# Altium schematic sheet Sheet1.SchDoc
size A4; Engineer: Nhóm 15
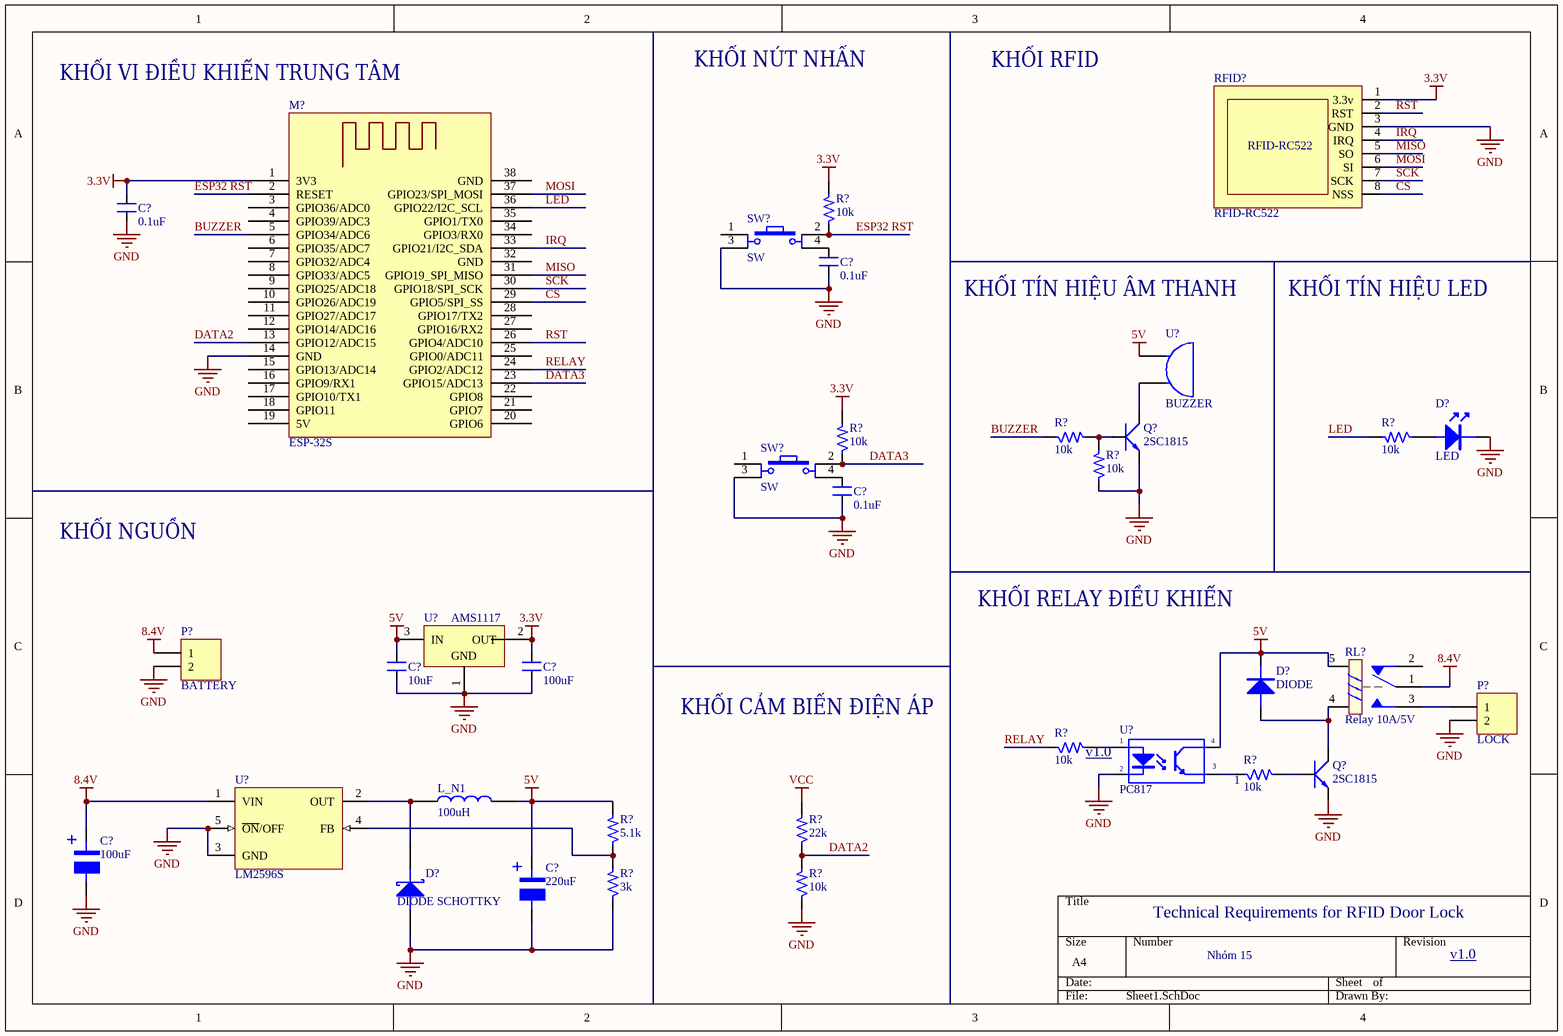
[diagram p0: Sheet1.SchDoc]

## Parts
(Parts that share a designator on the sheet are numbered #1, #2 ... from top to bottom, then left to right.)
C?#1  0.1uF  [CN4]
C?#2  0.1uF  [CN4]
C?#3  0.1uF  [CN4]
C?#4  10uF  [CN4]
C?#5  100uF  [CN4]
C?#6  100uF  [100UF/16V_SMD]
C?#7  220uF  [100UF/16V_SMD]
D?#1  LED  [CAP10UF]
D?#2  DIODE  [SMB]
D?#3  DIODE SCHOTTKY  [SMA]
L_N1  100uH  [100UH]
M?  ESP-32S  [ESP32 NodeMCU]
P?#1  BATTERY  [CON 2]
P?#2  LOCK  [CON 2]
Q?#1  2SC1815  [TO92-123]
Q?#2  2SC1815  [TO92-123]
R?#1  10k  [SM-0805]
R?#2  10k  [SM-0805]
R?#3  10k  [SM-0805]
R?#4  10k  [SM-0805]
R?#5  10k  [SM-0805]
R?#6  10k  [SM-0805]
R?#7  10k  [SM-0805]
R?#8  5.1k  [SM-0805]
R?#9  22k  [SM-0805]
R?#10  3k  [SM-0805]
R?#11  10k  [SM-0805]
RFID?  RFID-RC522  [RFID]
RL?  Relay 10A/5V  [RL_SPDT_10A]
SW?#1  SW  [SW4]
SW?#2  SW  [SW4]
U?#1  BUZZER
U?#2  AMS1117  [SOT223]
U?#3  PC817  [DIP4/W0.3]
U?#4  LM2596S  [TO263-5_Via40/10mil]

## Nets
3.3V: C?#1.2 C?#5.2 M?.1(3V3) R?#1.2 R?#2.2 RFID?.1(3.3v) U?#2.2(OUT) U?#2.4
5V: C?#4.2 C?#7.1 D?#2.2 L_N1.2 R?#8.2 RL?.5 U?#1.1(A) U?#2.3(IN) U?#3.4(C)
8.4V: C?#6.1 P?#1.1 RL?.1 U?#4.1(VIN)
GND: C?#1.1 C?#2.1 C?#3.1 C?#4.1 C?#5.1 C?#6.2 C?#7.2 D?#1.2 D?#3.1(A) M?.14(GND) P?#1.2 P?#2.2 Q?#1.1(E) Q?#2.1(E) R?#5.1 R?#10.1 R?#11.1 RFID?.3(GND) SW?#1.3 SW?#2.3 U?#2.1(GND) U?#3.2(K) U?#4.3(GND) U?#4.5(~{ON}/OFF)
VCC: R?#9.2
BUZZER: M?.5(GPIO34/ADC6) R?#3.1
CS: M?.29(GPIO5/SPI_SS) RFID?.8(NSS)
DATA2: M?.13(GPIO12/ADC15) R?#9.1 R?#11.2
DATA3: M?.23(GPIO15/ADC13) R?#2.1 SW?#2.2
ESP32 RST: M?.2(RESET) R?#1.1 SW?#1.2
IRQ: M?.33(GPIO21/I2C_SDA) RFID?.4(IRQ)
LED: M?.36(GPIO22/I2C_SCL) R?#4.2
MISO: M?.31(GPIO19_SPI_MISO) RFID?.5(SO)
MOSI: M?.37(GPIO23/SPI_MOSI) RFID?.6(SI)
RELAY: M?.24(GPIO2/ADC12) R?#6.1
RST: M?.26(GPIO4/ADC10) RFID?.2(RST)
SCK: M?.30(GPIO18/SPI_SCK) RFID?.7(SCK)
NetC?#2_2: C?#2.2 SW?#1.4
NetC?#3_2: C?#3.2 SW?#2.4
NetD?#1_1: D?#1.1 R?#4.1
NetD?#2_1: D?#2.1 Q?#2.2(C) RL?.4
NetD?#3_2: D?#3.2(K) L_N1.1 U?#4.2(OUT)
NetP?#2_1: P?#2.1 RL?.3
NetQ?#1_2: Q?#1.2(C) U?#1.2(B)
NetQ?#1_3: Q?#1.3(B) R?#3.2 R?#5.2
NetQ?#2_3: Q?#2.3(B) R?#7.2
NetR?#6_2: R?#6.2 U?#3.1(A)
NetR?#7_1: R?#7.1 U?#3.3(E)
NetR?#8_1: R?#8.1 R?#10.2 U?#4.4(FB)

Not connected (* = marked no-connect by the designer): M? 3(GPIO36/ADC0) 4(GPIO39/ADC3) 6(GPIO35/ADC7) 7(GPIO32/ADC4) 8(GPIO33/ADC5) 9(GPIO25/ADC18) 10(GPIO26/ADC19) 11(GPIO27/ADC17) 12(GPIO14/ADC16) 15(GPIO13/ADC14) 16(GPIO9/RX1) 17(GPIO10/TX1) 18(GPIO11) 19(5V) 20(GPIO6) 21(GPIO7) 22(GPIO8) 25(GPIO0/ADC11) 27(GPIO16/RX2) 28(GPIO17/TX2) 32(GND) 34(GPIO3/RX0) 35(GPIO1/TX0) 38(GND); RL? 2; SW?#1 1; SW?#2 1

## Notes on the sheet
- KHỐI RFID
- KHỐI VI ĐIỀU KHIỂN TRUNG TÂM
- KHỐI NÚT NHẤN
- KHỐI TÍN HIỆU ÂM THANH
- KHỐI TÍN HIỆU LED
- KHỐI NGUỒN
- KHỐI RELAY ĐIỀU KHIỂN
- KHỐI CẢM BIẾN ĐIỆN ÁP
- (near R?#6) v1.0
- (near R?#7) 1
- Technical Requirements for RFID Door Lock
- Nhóm 15
- v1.0
- (in symbol Cap100uF_SMD) +

## Library data of the parts
C?#1-C?#5 = CN4: Cap np W0.4; Value: 0.47uF
C?#6 = Cap100uF_SMD: Value: 100uF
C?#7 = Cap100uF_SMD: Value: 100uF
D?#3 = DIODE SCHOTTKY: Schottky Diode
L_N1 = INDUCTOR1
M? = WIFI_ESP-32S_Development Board: ESP32 NodeMCU LuaNode32 38 Pins
P?#1 P?#2 = HEADER 2
Q?#1 Q?#2 = 2SC1815: NPN 600mW, ECB; Value: C1815
R?#1-R?#11 = Res: Resistor 1/4W; Value: R1/4W - 1K
RFID? = RFID
RL? = Relay 1: Relay SPDT,10A - 12VDC 5 Pin; Value: Relay SPDT, 10A, 12V
SW?#1 SW?#2 = SW4: Switch button 4 pin; Value: Button chip 4 pin
U?#2 = AMS117
U?#3 = PC817_1: Single Opto; Value: PC817
U?#4 = LM2596: SIMPLE SWITCHER; 3A Step-Down Voltage Regulator; PartNumber: LM2596S-5.0; Manufacturer: National Semiconductor; PowerWise: N; FirstPublished: 4-Dec-2008; DatasheetVersion: Aug-2004; PackageVersion: revJ, Jan-1992; PackageReference: T05A; Publisher: Altium Limited; PackageDescription: TO-220, Molded, 5 Lead, Straight; CompType: Switcher; PinCount: 5; DigiKeyPartNumber: LM2576T-5.0-ND; ComponentLink3URL: http://www.national.com/packaging/folders/t05a.html